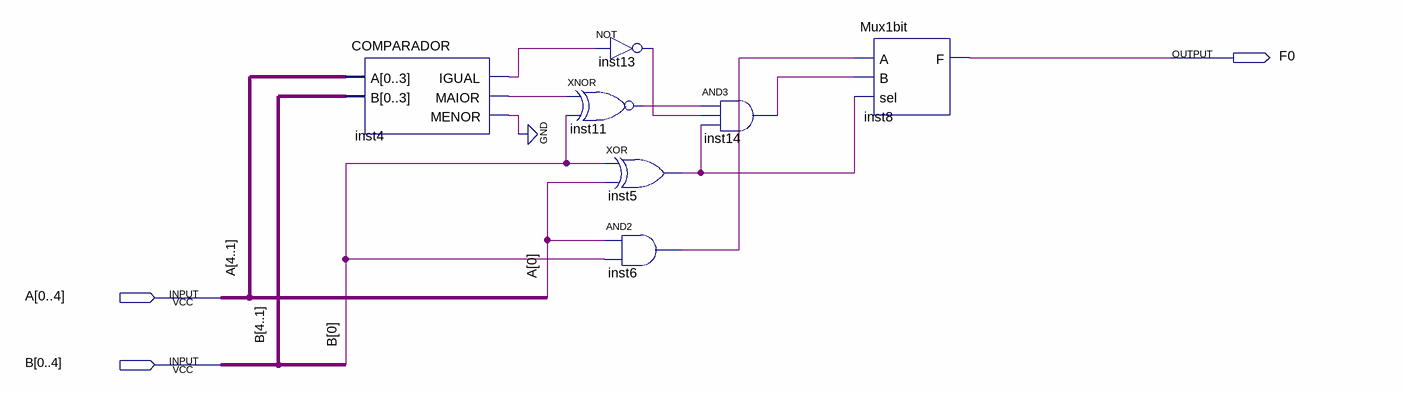
[diagram p0: schematic sheet]
// Quartus schematic DecoderSinal.bdf as structural Verilog: 7 symbols, 3 pins
module DecoderSinal (
  input  [0:4] A,
  input  [0:4] B,
  output F0
);

  wire inst4_igual, inst4_maior, inst4_menor, inst5_out, inst6_out, inst11_out, inst13_out, inst14_out;

  COMPARADOR inst4 (
    .A({A[4], A[3], A[2], A[1]}), .B({B[4], B[3], B[2], B[1]}), .IGUAL(inst4_igual), .MAIOR(inst4_maior),
    .MENOR(inst4_menor));
  xnor inst11 (inst11_out, inst4_maior, B[0]);
  not inst13 (inst13_out, inst4_igual);
  xor inst5 (inst5_out, B[0], A[0]);
  and inst6 (inst6_out, A[0], B[0]);
  and inst14 (inst14_out, inst11_out, inst13_out, inst5_out);
  Mux1bit inst8 (.A(inst6_out), .B(inst14_out), .sel(inst5_out), .F(F0));
  // also tied to GND on the sheet: inst4_menor
endmodule
